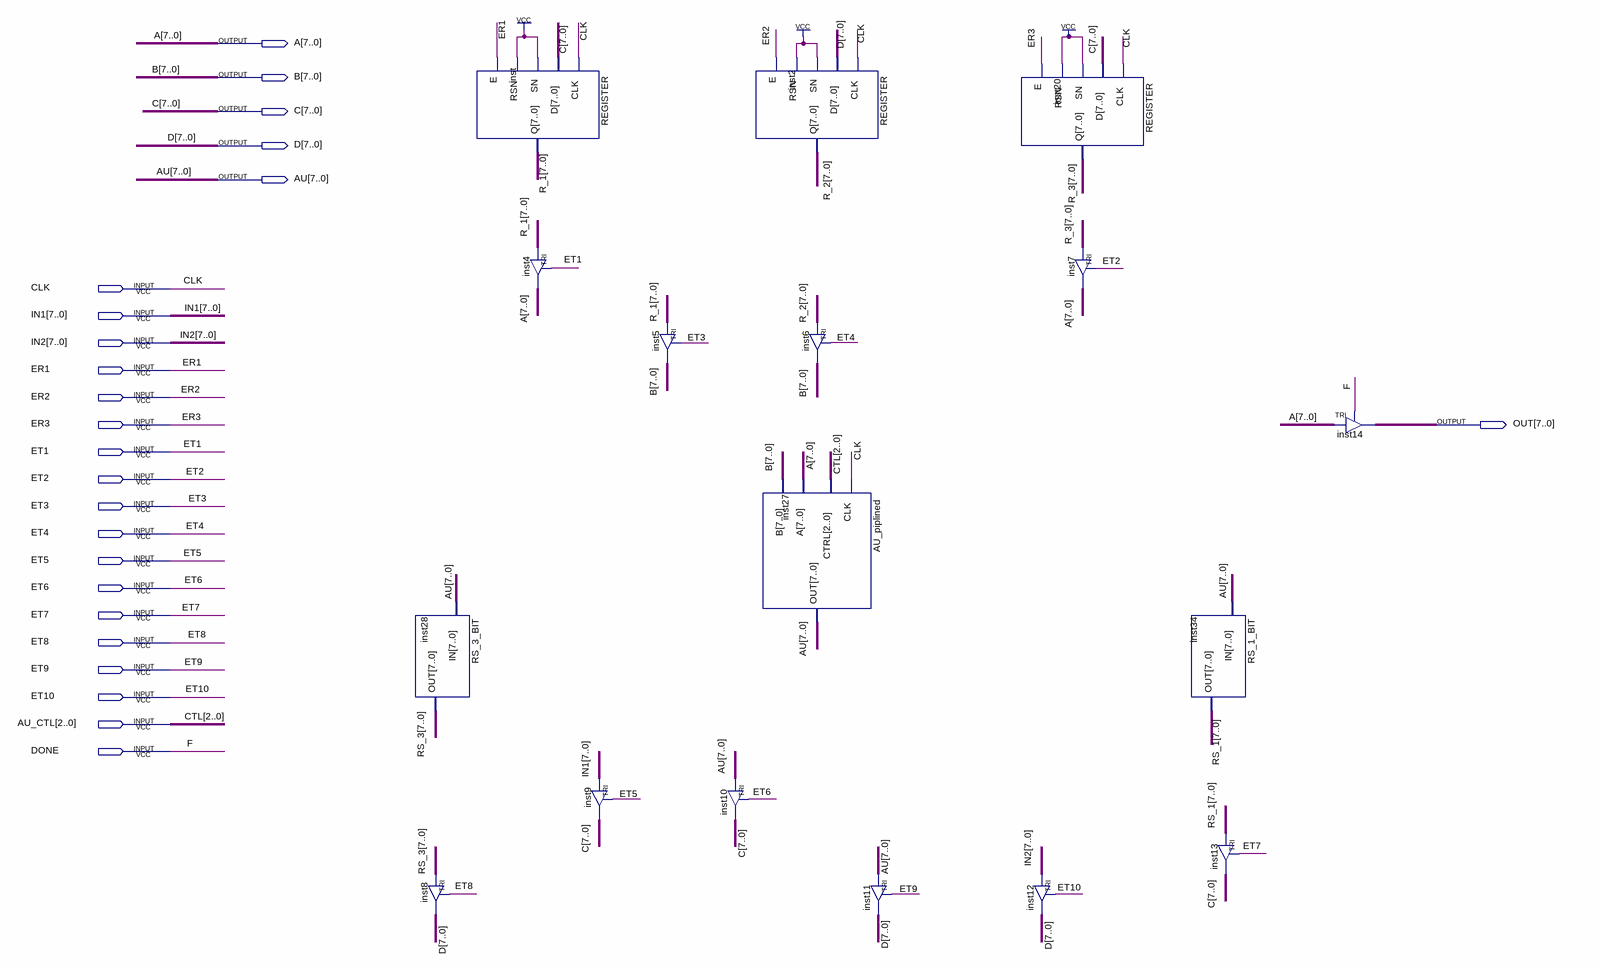
[diagram p0: schematic sheet]
// Quartus schematic Pipelined_Function_DATAPATH.bdf as structural Verilog: 17 symbols, 24 pins
module Pipelined_Function_DATAPATH (
  input  CLK,
  input  [7:0] IN1,
  input  [7:0] IN2,
  input  ER1,
  input  ER2,
  input  ER3,
  input  ET1,
  input  ET2,
  input  ET3,
  input  ET4,
  input  ET5,
  input  ET6,
  input  ET7,
  input  ET8,
  input  ET9,
  input  ET10,
  input  [2:0] AU_CTL,
  input  DONE,
  output [7:0] A,
  output [7:0] B,
  output [7:0] C,
  output [7:0] D,
  output [7:0] AU,
  output [7:0] OUT
);

  wire [7:0] R_1, R_2, R_3, RS_1, RS_3;

  RS_3_BIT inst28 (.IN(AU), .OUT(RS_3));
  TRI inst8[7:0] (.IN(RS_3), .OE(ET8), .OUT(D));
  REGISTER inst (.CLK(CLK), .D(C), .SN(1'b1), .RSN(1'b1), .E(ER1), .Q(R_1));
  TRI inst4[7:0] (.IN(R_1), .OE(ET1), .OUT(A));
  TRI inst9[7:0] (.IN(IN1), .OE(ET5), .OUT(C));
  TRI inst5[7:0] (.IN(R_1), .OE(ET3), .OUT(B));
  TRI inst10[7:0] (.IN(AU), .OE(ET6), .OUT(C));
  REGISTER inst2 (.CLK(CLK), .D(D), .SN(1'b1), .RSN(1'b1), .E(ER2), .Q(R_2));
  AU_piplined inst27 (.CLK(CLK), .CTRL(AU_CTL), .A(A), .B(B), .OUT(AU));
  TRI inst6[7:0] (.IN(R_2), .OE(ET4), .OUT(B));
  TRI inst11[7:0] (.IN(AU), .OE(ET9), .OUT(D));
  REGISTER inst20 (.CLK(CLK), .D(C), .SN(1'b1), .RSN(1'b1), .E(ER3), .Q(R_3));
  TRI inst12[7:0] (.IN(IN2), .OE(ET10), .OUT(D));
  TRI inst7[7:0] (.IN(R_3), .OE(ET2), .OUT(A));
  RS_1_BIT inst34 (.IN(AU), .OUT(RS_1));
  TRI inst13[7:0] (.IN(RS_1), .OE(ET7), .OUT(C));
  TRI inst14[7:0] (.IN(A), .OE(DONE), .OUT(OUT));

  // Other names for the same wires on the sheet: CTL[2:0] = AU_CTL; F = DONE
endmodule
